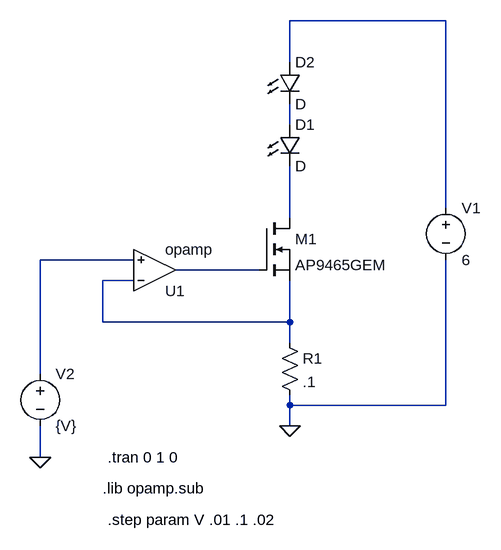
[diagram p0: schematic LEDCurrentDriver.asc]
LEDCurrentDriver.asc, the LTspice schematic file:
Version 4
SHEET 1 880 704
WIRE 688 -80 448 -80
WIRE 448 -16 448 -80
WIRE 448 80 448 48
WIRE 688 208 688 -80
WIRE 448 224 448 144
WIRE 208 288 64 288
WIRE 400 304 272 304
WIRE 208 320 160 320
WIRE 160 384 160 320
WIRE 448 384 448 320
WIRE 448 384 160 384
WIRE 448 416 448 384
WIRE 64 464 64 288
WIRE 448 512 448 496
WIRE 688 512 688 288
WIRE 688 512 448 512
WIRE 448 544 448 512
WIRE 64 592 64 544
FLAG 448 544 0
FLAG 64 592 0
SYMBOL Opamps/opamp 240 368 M180
SYMATTR InstName U1
SYMBOL nmos 400 224 R0
SYMATTR InstName M1
SYMATTR Value AP9465GEM
SYMBOL LED 432 80 R0
SYMATTR InstName D1
SYMBOL voltage 688 192 R0
SYMATTR InstName V1
SYMATTR Value 6
SYMBOL res 432 400 R0
SYMATTR InstName R1
SYMATTR Value .1
SYMBOL LED 432 -16 R0
SYMATTR InstName D2
SYMBOL voltage 64 448 R0
SYMATTR InstName V2
SYMATTR Value {V}
TEXT 160 640 Left 2 !.lib opamp.sub
TEXT 168 592 Left 2 !.tran 0 1 0
TEXT 168 688 Left 2 !.step param V .01 .1 .02

The netlist it stands for:
* LEDCurrentDriver.asc
XU1 N006 N004 N005 opamp Aol=100K GBW=10Meg  ; pins invin noninvin out
M1 N003 N005 N006 N006 AP9465GEM
D1 N002 N003 D
V1 N001 0 6
R1 N006 0 .1
D2 N001 N002 D
V2 N004 0 {V}
.model D D
.lib standard.dio
.model NMOS NMOS
.model PMOS PMOS
.lib standard.mos
.lib opamp.sub
.tran 0 1 0
.step param V .01 .1 .02
.backanno
.end